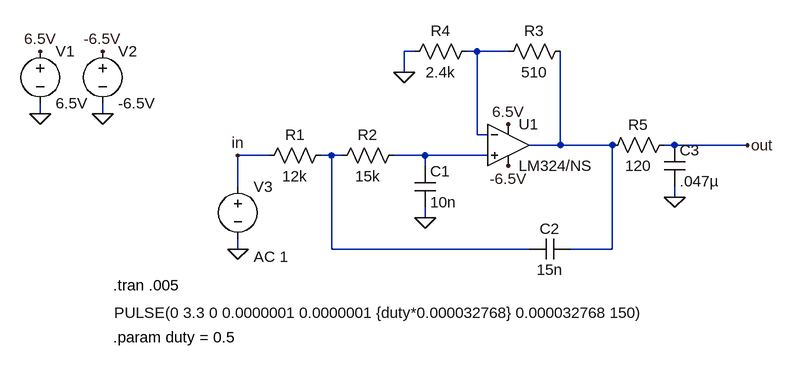
[diagram p0: schematic Mod_Amt.asc]
Mod_Amt.asc, the LTspice schematic file:
Version 4
SHEET 1 916 680
WIRE 256 32 240 32
WIRE 352 32 336 32
WIRE 400 32 352 32
WIRE 240 64 240 32
WIRE -320 128 -320 112
WIRE -224 128 -224 112
WIRE 352 160 352 32
WIRE 368 160 352 160
WIRE 480 176 480 32
WIRE 480 176 432 176
WIRE 560 176 480 176
WIRE 656 176 640 176
WIRE 768 176 656 176
WIRE 32 192 -16 192
WIRE 128 192 112 192
WIRE 144 192 128 192
WIRE 272 192 224 192
WIRE 368 192 272 192
WIRE 272 208 272 192
WIRE -16 240 -16 192
WIRE 656 256 656 240
WIRE 272 288 272 272
WIRE -16 336 -16 320
WIRE 128 336 128 192
WIRE 432 336 128 336
WIRE 560 336 560 176
WIRE 560 336 496 336
FLAG -224 128 0
FLAG -320 128 0
FLAG -224 32 -6.5V
FLAG 400 208 -6.5V
FLAG -16 336 0
FLAG -16 192 in
FLAG -320 32 6.5V
FLAG 400 144 6.5V
FLAG 272 288 0
FLAG 240 64 0
FLAG 768 176 out
FLAG 656 256 0
SYMBOL ZZZ\\OpAmp\\LM324 400 176 R0
SYMATTR InstName U1
SYMBOL voltage -320 16 R0
WINDOW 123 0 0 Left 0
WINDOW 39 0 0 Left 0
SYMATTR InstName V1
SYMATTR Value 6.5V
SYMBOL voltage -224 16 R0
WINDOW 123 0 0 Left 0
WINDOW 39 0 0 Left 0
SYMATTR InstName V2
SYMATTR Value -6.5V
SYMBOL voltage -16 224 R0
WINDOW 3 -190 210 Left 2
WINDOW 123 24 124 Left 2
WINDOW 39 0 0 Left 0
SYMATTR Value PULSE(0 3.3 0 0.0000001 0.0000001 {duty*0.000032768} 0.000032768 150)
SYMATTR Value2 AC 1
SYMATTR InstName V3
SYMBOL res 128 176 R90
WINDOW 0 0 56 VBottom 2
WINDOW 3 32 56 VTop 2
SYMATTR InstName R1
SYMATTR Value 12k
SYMBOL res 240 176 R90
WINDOW 0 0 56 VBottom 2
WINDOW 3 32 56 VTop 2
SYMATTR InstName R2
SYMATTR Value 15k
SYMBOL cap 256 208 R0
SYMATTR InstName C1
SYMATTR Value 10n
SYMBOL cap 496 320 R90
WINDOW 0 0 32 VBottom 2
WINDOW 3 32 32 VTop 2
SYMATTR InstName C2
SYMATTR Value 15n
SYMBOL res 496 16 R90
WINDOW 0 0 56 VBottom 2
WINDOW 3 32 56 VTop 2
SYMATTR InstName R3
SYMATTR Value 510
SYMBOL res 352 16 R90
WINDOW 0 0 56 VBottom 2
WINDOW 3 32 56 VTop 2
SYMATTR InstName R4
SYMATTR Value 2.4k
SYMBOL res 656 160 R90
WINDOW 0 0 56 VBottom 2
WINDOW 3 32 56 VTop 2
SYMATTR InstName R5
SYMATTR Value 120
SYMBOL cap 640 176 R0
SYMATTR InstName C3
SYMATTR Value .047µ
TEXT -208 392 Left 2 !.tran .005
TEXT -208 472 Left 2 !.param duty = 0.5

The netlist it stands for:
* Mod_Amt.asc
XU1 N004 N001 6.5V -6.5V N002 LM324/NS  ; pins In+ In- V+ V- OUT
V1 6.5V 0 6.5V
V2 -6.5V 0 -6.5V
V3 in 0 PULSE(0 3.3 0 0.0000001 0.0000001 {duty*0.000032768} 0.000032768 150) AC 1
R1 N003 in 12k
R2 N004 N003 15k
C1 N004 0 10n
C2 N002 N003 15n
R3 N002 N001 510
R4 N001 0 2.4k
R5 out N002 120
C3 out 0 .047µ
.tran .005
.param duty = 0.5
.backanno
.end